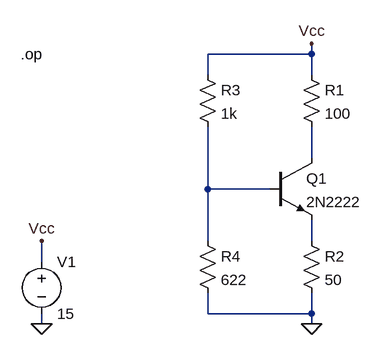
[diagram p0: schematic DC Operating Point.asc]
DC Operating Point.asc, the LTspice schematic file:
Version 4
SHEET 1 3528 680
WIRE 528 -608 528 -624
WIRE 528 -608 368 -608
WIRE 368 -576 368 -608
WIRE 528 -576 528 -608
WIRE 528 -448 528 -496
WIRE 368 -400 368 -496
WIRE 464 -400 368 -400
WIRE 368 -320 368 -400
WIRE 528 -320 528 -352
WIRE 112 -288 112 -320
WIRE 368 -208 368 -240
WIRE 528 -208 528 -240
WIRE 528 -208 368 -208
WIRE 112 -192 112 -208
WIRE 528 -192 528 -208
FLAG 112 -192 0
FLAG 112 -320 Vcc
FLAG 528 -624 Vcc
FLAG 528 -192 0
SYMBOL voltage 112 -304 R0
WINDOW 123 0 0 Left 0
WINDOW 39 0 0 Left 0
SYMATTR InstName V1
SYMATTR Value 15
SYMBOL res 512 -592 R0
SYMATTR InstName R1
SYMATTR Value 100
SYMBOL npn 464 -448 R0
SYMATTR InstName Q1
SYMATTR Value 2N2222
SYMBOL res 512 -336 R0
SYMATTR InstName R2
SYMATTR Value 50
SYMBOL res 352 -592 R0
SYMATTR InstName R3
SYMATTR Value 1k
SYMBOL res 352 -336 R0
SYMATTR InstName R4
SYMATTR Value 622
TEXT 80 -608 Left 2 !.op

The netlist it stands for:
* DC Operating Point.asc
V1 Vcc 0 15
R1 Vcc N001 100
Q1 N001 N002 N003 0 2N2222
R2 N003 0 50
R3 Vcc N002 1k
R4 N002 0 622
.model NPN NPN
.model PNP PNP
.lib standard.bjt
.op
.backanno
.end